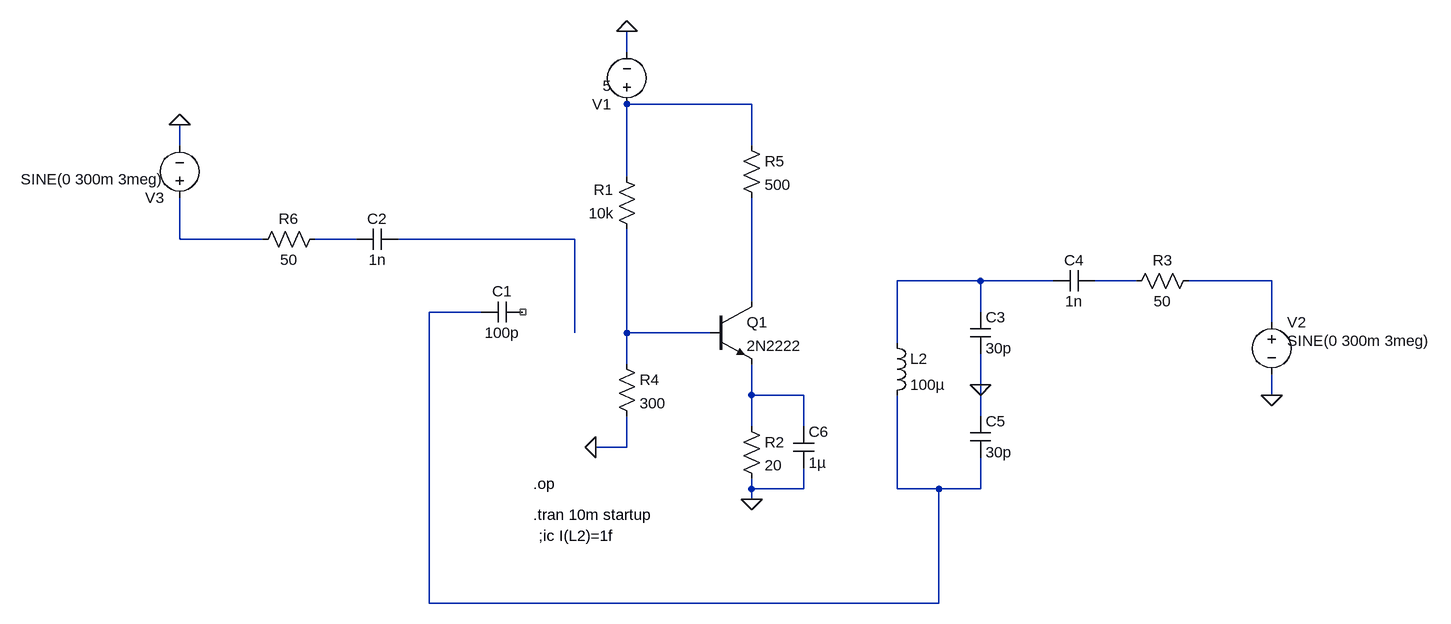
[diagram p0: schematic dem-colpin.asc]
dem-colpin.asc, the LTspice schematic file:
Version 4
SHEET 1 1380 680
WIRE 0 -304 0 -336
WIRE 192 -224 0 -224
WIRE -688 -160 -688 -192
WIRE 192 -160 192 -224
WIRE 0 -112 0 -224
WIRE -688 -16 -688 -80
WIRE -560 -16 -688 -16
WIRE -416 -16 -480 -16
WIRE -80 -16 -352 -16
WIRE 544 48 416 48
WIRE 656 48 544 48
WIRE 784 48 720 48
WIRE 992 48 864 48
WIRE 192 80 192 -80
WIRE -224 96 -304 96
WIRE 544 96 544 48
WIRE 992 112 992 48
WIRE -80 128 -80 -16
WIRE 0 128 0 -32
WIRE 128 128 0 128
WIRE 416 144 416 48
WIRE 0 176 0 128
WIRE 544 208 544 160
WIRE 192 224 192 176
WIRE 272 224 192 224
WIRE 992 224 992 192
WIRE 544 256 544 208
WIRE 192 272 192 224
WIRE 272 272 272 224
WIRE 0 304 0 256
WIRE 0 304 -48 304
WIRE 192 368 192 352
WIRE 272 368 272 336
WIRE 272 368 192 368
WIRE 416 368 416 224
WIRE 480 368 416 368
WIRE 544 368 544 320
WIRE 544 368 480 368
WIRE 192 384 192 368
WIRE -304 544 -304 96
WIRE 480 544 480 368
WIRE 480 544 -304 544
FLAG 0 -336 0
FLAG 192 384 0
FLAG -48 304 0
FLAG 544 208 0
FLAG 992 224 0
FLAG -688 -192 0
DATAFLAG 592 464 ""
DATAFLAG 192 224 ""
DATAFLAG 80 128 ""
DATAFLAG 32 128 ""
SYMBOL res 16 -16 R180
WINDOW 0 36 76 Left 2
WINDOW 3 36 40 Left 2
SYMATTR InstName R1
SYMATTR Value 10k
SYMBOL voltage 0 -208 R180
WINDOW 3 24 44 Left 2
WINDOW 123 0 0 Left 0
WINDOW 39 0 0 Left 0
SYMATTR Value 5
SYMATTR InstName V1
SYMBOL res -16 160 R0
SYMATTR InstName R4
SYMATTR Value 300
SYMBOL cap 528 96 R0
SYMATTR InstName C3
SYMATTR Value 30p
SYMBOL cap 528 256 R0
SYMATTR InstName C5
SYMATTR Value 30p
SYMBOL ind 400 128 R0
SYMATTR InstName L2
SYMATTR Value 100µ
SYMBOL res 176 256 R0
SYMATTR InstName R2
SYMATTR Value 20
SYMBOL cap 256 272 R0
SYMATTR InstName C6
SYMATTR Value 1µ
SYMBOL res 176 -176 R0
SYMATTR InstName R5
SYMATTR Value 500
SYMBOL cap -160 80 R90
WINDOW 0 0 32 VBottom 2
WINDOW 3 32 32 VTop 2
SYMATTR InstName C1
SYMATTR Value 100p
SYMBOL npn 128 80 R0
SYMATTR InstName Q1
SYMATTR Value 2N2222
SYMBOL voltage 992 96 R0
WINDOW 123 0 0 Left 0
WINDOW 39 0 0 Left 0
WINDOW 3 24 44 Left 2
SYMATTR InstName V2
SYMATTR Value SINE(0 300m 3meg)
SYMBOL cap 720 32 R90
WINDOW 0 0 32 VBottom 2
WINDOW 3 32 32 VTop 2
SYMATTR InstName C4
SYMATTR Value 1n
SYMBOL res 880 32 R90
WINDOW 0 0 56 VBottom 2
WINDOW 3 32 56 VTop 2
SYMATTR InstName R3
SYMATTR Value 50
SYMBOL voltage -688 -64 R180
WINDOW 123 0 0 Left 0
WINDOW 39 0 0 Left 0
WINDOW 3 24 44 Left 2
SYMATTR InstName V3
SYMATTR Value SINE(0 300m 3meg)
SYMBOL cap -416 0 R270
WINDOW 0 32 32 VTop 2
WINDOW 3 0 32 VBottom 2
SYMATTR InstName C2
SYMATTR Value 1n
SYMBOL res -576 0 R270
WINDOW 0 32 56 VTop 2
WINDOW 3 0 56 VBottom 2
SYMATTR InstName R6
SYMATTR Value 50
TEXT -144 360 Left 2 !.op
TEXT -144 408 Left 2 !.tran 10m startup
TEXT -136 440 Left 2 !;ic I(L2)=1f

The netlist it stands for:
* dem-colpin.asc
R1 N010 N001 10k
V1 N001 0 5
R4 N010 0 300
C3 N005 0 30p
C5 0 N009 30p
L2 N005 N009 100µ
R2 N011 0 20
C6 N011 0 1µ
R5 N001 N008 500
C1 NC_01 N009 100p
Q1 N008 N010 N011 0 2N2222
V2 N007 0 SINE(0 300m 3meg)
C4 N006 N005 1n
R3 N007 N006 50
V3 N002 0 SINE(0 300m 3meg)
C2 N003 N004 1n
R6 N002 N003 50
.model NPN NPN
.model PNP PNP
.lib standard.bjt
.op
.tran 10m startup
;ic I(L2)=1f
.backanno
.end